# EAGLE design led_strip (EAGLE 6.1)
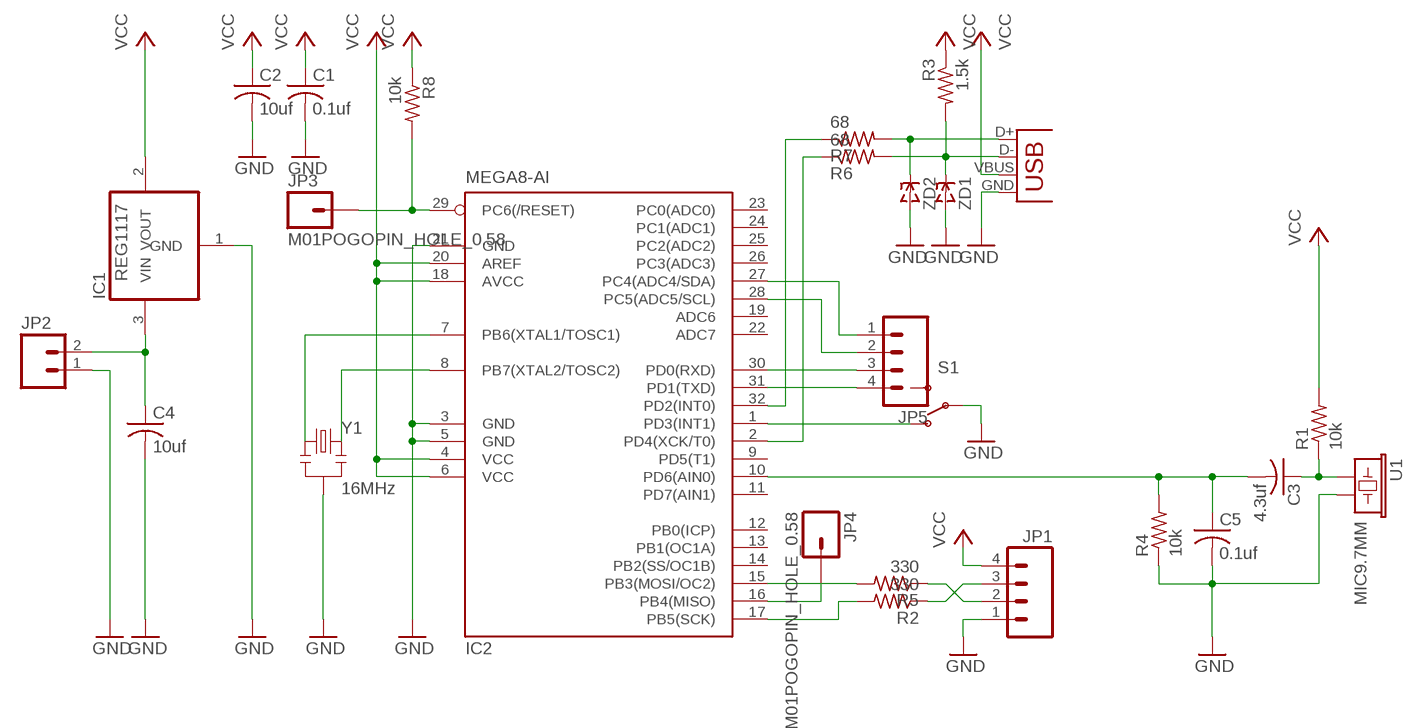
[diagram p0: schematic, sheet 1]

## Parts
C1  0.1uf  C-USC0805  [C0805]
C2  10uf  C-USC0805  [C0805]
C3  4.3uf  C-USC0805  [C0805]
C4  10uf  C-USC0805  [C0805]
C5  0.1uf  C-USC0805  [C0805]
IC1  REG1117  [SOT223]
IC2  MEGA8-AI  [TQFP32-08]
JP1  M04LONGPADS  [1X04_LONGPADS]
JP2  M02LOCK_LONGPADS  [1X02_LOCK_LONGPADS]
JP3  M01POGOPIN_HOLE_0.58  [1X01_POGOPIN_HOLE_0.58]
JP4  M01POGOPIN_HOLE_0.58  [1X01_POGOPIN_HOLE_0.58]
JP5  M04PTH  [1X04]
R1  10k  R-US_R0805  [R0805]
R2  330  R-US_R0805  [R0805]
R3  1.5k  R-US_R0805  [R0805]
R4  10k  R-US_R0805  [R0805]
R5  330  R-US_R0805  [R0805]
R6  68  R-US_R0805  [R0805]
R7  68  R-US_R0805  [R0805]
R8  10k  R-US_R0805  [R0805]
S1  SWITCH-SPSTSMD2  [SWITCH-SPDT-SMD]
U1  MIC9.7MM  [MIC-9.7MM]
X1  USB-SMD-NS  [USB-MINIB-NOSTOP]
Y1  16MHz  RESONATORSMD  [RESONATOR-SMD]
ZD1  ZENERSOD-323F  [SOD-323F]
ZD2  ZENERSOD-323F  [SOD-323F]

## Nets
GND: C1.2 C2.2 C4.2 C5.2 IC1.1(GND) IC2.3(GND) IC2.5(GND) IC2.21(GND) JP1.1 JP2.1 R4.1 S1.2(P) U1.2 X1.GND Y1.2 ZD1.A ZD2.A
N$1: IC2.17(PB5(SCK)) R2.2
N$2: IC2.16(PB4(MISO)) JP4.1
N$3: JP1.2 R5.1
N$4: R7.2 X1.D+ ZD2.C
N$5: R3.2 R6.2 X1.D- ZD1.C
N$6: IC2.7(PB6(XTAL1/TOSC1)) Y1.1
N$7: IC2.29(PC6(/RESET)) JP3.1 R8.2
N$8: IC2.8(PB7(XTAL2/TOSC2)) Y1.3
N$9: C3.2 C5.1 IC2.10(PD6(AIN0)) R4.2
N$10: C3.1 R1.1 U1.1
N$11: IC2.2(PD4(XCK/T0)) R6.1
N$12: IC2.32(PD2(INT0)) R7.1
N$13: IC2.1(PD3(INT1)) S1.1(O)
N$14: JP1.3 R2.1
N$15: IC2.15(PB3(MOSI/OC2)) R5.2
N$16: IC2.30(PD0(RXD)) JP5.3
N$17: IC2.31(PD1(TXD)) JP5.4
N$18: IC2.28(PC5(ADC5/SCL)) JP5.2
N$19: IC2.27(PC4(ADC4/SDA)) JP5.1
N$20: C4.1 IC1.3(VIN) JP2.2
VCC: C1.1 C2.1 IC1.2(VOUT) IC2.4(VCC) IC2.6(VCC) IC2.18(AVCC) IC2.20(AREF) JP1.4 R1.2 R3.1 R8.1 X1.VBUS
Unconnected: IC2.9(PD5(T1)) IC2.11(PD7(AIN1)) IC2.12(PB0(ICP)) IC2.13(PB1(OC1A)) IC2.14(PB2(SS/OC1B)) IC2.19(ADC6) IC2.22(ADC7) IC2.23(PC0(ADC0)) IC2.24(PC1(ADC1)) IC2.25(PC2(ADC2)) IC2.26(PC3(ADC3)) S1.3(S)

## Library data of the parts
C1-C5 = adafruit:C-US: CAPACITOR, American symbol
IC1 = burr-brown:REG1117: 800mA and 1A Low Dropout (LDO) Positive Regulator 1.8V, 2.5V, 2.85V, 3.3V, 5V, and Adj; MPN: REG1117; OC_FARNELL: 1097566; OC_NEWARK: 14P6981
IC2 = atmel:MEGA8: MICROCONTROLLER 8 Kbytes FLASH, 1 kbytes SRAM, 512 bytes EEPROM, USART, 6-channel 10 bit ADC, 2-channel 8 bit ADC Pin compatible with Atmega48, ATMega88, ATMega168 Source: avr.lbr; MPN: ATMEGA8-16AU; OC_FARNELL: 9171371; OC_NEWARK: 73M8863
JP1 JP5 = sparkfun:M04: Header 4 Standard 4-pin 0.1" header. Use with straight break away headers (SKU : PRT-00116), right angle break away headers (PRT-00553), swiss pins (PRT-00743), machine pins (PRT-00117), and female headers (PRT-00115). Molex polarized connector foot print use with SKU : PRT-08231 with associated crimp pins and housings. 1MM SMD Version SKU: PRT-10208
JP2 = sparkfun:M02: Header 2 Standard 2-pin 0.1" header. Use with straight break away headers (SKU : PRT-00116), right angle break away headers (PRT-00553), swiss pins (PRT-00743), machine pins (PRT-00117), and female headers (PRT-00115). Molex polarized connector foot print use with SKU : PRT-08233 with associated crimp pins and housings.
JP3 JP4 = sparkfun:M01: Header 1 Standard 1-pin 0.1" header. Use with straight break away headers (SKU : PRT-00116), right angle break away headers (PRT-00553), swiss pins (PRT-00743), machine pins (PRT-00117), and female headers (PRT-00115).
R1-R8 = adafruit:R-US_: RESISTOR, American symbol
S1 = sparkfun:SWITCH-SPST: SPST Switch Simple slide switch. Spark Fun Electronics SKU : COM-00102
U1 = sparkfun:MIC: Microphone Omni-directional electret microphone. 9.7mm standard diameter.
X1 = sparkfun:USB: USB Connectors USB-B-PTH is fully proven SKU : PRT-00139 USB-miniB is fully proven SKU : PRT-00587 USB-A-PCB is untested. USB-A-H is throughly reviewed, but untested. Spark Fun Electronics SKU : PRT-00437 USB-B-SMT is throughly reviewed, but untested. Needs silkscreen touching up. USB-A-S has not been used/tested USB-MB-H has not been used/tested
Y1 = sparkfun:RESONATOR: Resonator Small SMD resonator. This is the itty bitty 10/20MHz resonators with built in caps. CSTCE10M0G55 and CSTCE20M0V53. Footprint has been reviewed closely but hasn't been tested yet.
ZD1 ZD2 = dp_devices:ZENER: Zener Diode SOD-323

## Board
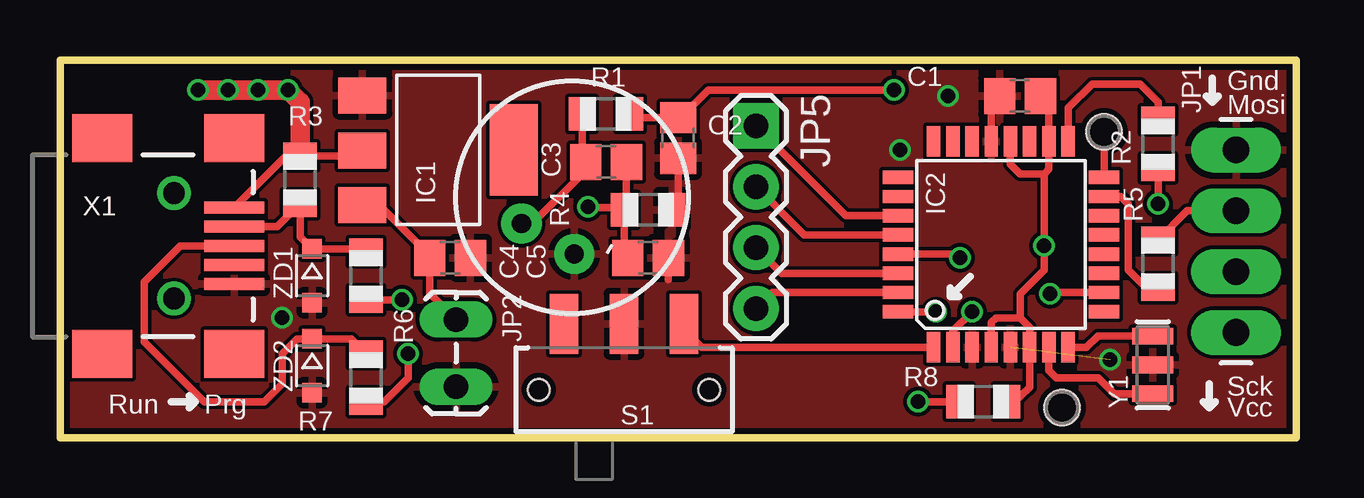
[diagram p1: board, top side]
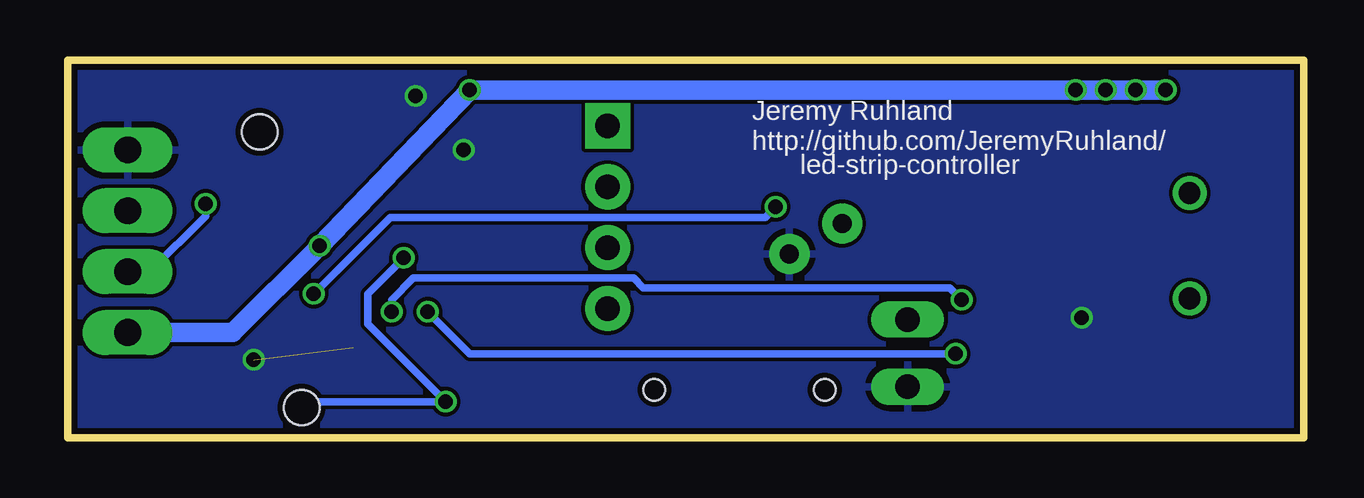
[diagram p2: board, bottom side, seen from below]

Size 51.5 x 15.75 mm. Coordinates in mm from the lower left corner, seen from the top.
Outline: 0,15.75 51.5,15.75 51.5,0 0,0 0,15.75
Copper layers (1*16): Top 0.035mm / dielectric 1.5mm / Bottom 0.035mm
Design rules: minimum track width 6mil, minimum drill 12mil, track to track 6mil, track to pad 6mil, pad to pad 6mil, via to via 6mil, smd to smd 0mil, copper to edge 10mil, drill to drill 10mil, minimum pad ring 10mil, minimum via ring 6mil, stop-mask expansion 2mil, vias tented up to drill 100mil, thermal gap 10mil

### Footprints (pad centres in the part's own frame; a part is rotated, then mirrored left to right if it is on the bottom)
C0805 = smd 1.3 x 1.5: 1 -0.85,0; 2 0.85,0
SOT223 = smd 1.499 x 2.007: 1 -2.261,-3.15; 2 0.025,-3.15; 3 2.311,-3.15 | smd 3.81 x 2.007: 4 0,3.15
TQFP32-08 = smd 1.27 x 0.559: 1 -4.293,2.8; 2 -4.293,2; 3 -4.293,1.2; 4 -4.293,0.4; 5 -4.293,-0.4; 6 -4.293,-1.2; 7 -4.293,-2; 8 -4.293,-2.8; 17 4.293,-2.8; 18 4.293,-2; 19 4.293,-1.2; 20 4.293,-0.4; 21 4.293,0.4; 22 4.293,1.2; 23 4.293,2; 24 4.293,2.8 | smd 0.559 x 1.27: 9 -2.8,-4.293; 10 -2,-4.293; 11 -1.2,-4.293; 12 -0.4,-4.293; 13 0.4,-4.293; 14 1.2,-4.293; 15 2,-4.293; 16 2.8,-4.293; 25 2.8,4.293; 26 2,4.293; 27 1.2,4.293; 28 0.4,4.293; 29 -0.4,4.293; 30 -1.2,4.293; 31 -2,4.293; 32 -2.8,4.293
1X04_LONGPADS = drill 1.118 pad 1.88 long: 1 0,0; 2 2.54,0; 3 5.08,0; 4 7.62,0
1X02_LOCK_LONGPADS = drill 1.016 long: 1 -0.127,0; 2 2.667,0
1X01_POGOPIN_HOLE_0.58 = drill 0.9 pad 0.813: 1 0,0 | hole 1.473: 0,0
1X04 = drill 1.016 pad 1.88 square: 1 0,0 | drill 1.016 pad 1.88: 2 2.54,0; 3 5.08,0; 4 7.62,0
R0805 = smd 1.1 x 1.4: 1 -1,0; 2 1,0
SWITCH-SPDT-SMD = smd 1.2 x 2.5: 1 -2.5,-2.75; 2 0,-2.75; 3 2.5,-2.75 | hole 0.9: -3.55,0; 3.55,0
MIC-9.7MM = drill 0.8 pad 1.676: 1 -2,1.27; 2 -2,-1.27
USB-MINIB-NOSTOP = smd 2.5 x 0.5: D+ 2.5,0; D- 2.5,0.8; GND 2.5,-1.6; ID 2.5,-0.8; VBUS 2.5,1.6 | smd 2.5 x 2: G1 -3,-4.5; G2 -3,4.5; G3 2.5,4.5; G4 2.5,-4.5 | drill 0.9 pad 0.8: H1 0,2.2 | drill 0.9 pad 0.787: H2 0,-2.2
RESONATOR-SMD = smd 0.7 x 1.7: 1 -1.2,0; 2 0,0; 3 1.2,0
SOD-323F = smd 0.8 x 0.8: A 1.125,0; C -1.125,0

### Placement (x,y rotation side)
C1  40,14.25 180 top
C2  25.75,12.5 270 top
C3  22.75,11.5 0 top
C4  16.25,7.5 0 top
C5  24.5,7.5 0 top
IC1  15.75,12 270 top
IC2  39.2,8.05 90 top
JP1  49,12 270 top
JP2  16.5,2.25 90 top
JP3  41.75,1.25 0 top
JP4  43.5,12.75 0 top
JP5  29,13 270 top
R1  22.75,13.5 0 top
R2  45.75,12.25 90 top
R3  10,10.75 270 top
R4  24.5,9.5 180 top
R5  45.75,7.25 270 top
R6  12.75,6.75 90 top
R7  12.75,2.5 90 top
R8  38.47,1.5 180 top
S1  23.5,2 180 top
U1  21.33,10.02 60 top
X1  4.75,8 0 top
Y1  45.53,3.03 90 top
ZD1  10.5,6.75 270 top
ZD2  10.5,3 270 top

### Tracks (layer width: path | path; a pad name or v marks a point on that pad's centre or on a via)
GND  (via drill 0.6)  (1 unrouted)
  Top 0.305: IC2.21 38.8,13.9 C1.2 | C5.2 25.35,6.6 | C2.2 25.75,9.75 R4.1
  other vias: 35,12 37,14.25 43.75,3.25 9.25,5
  pour Top: 0.25,15.75 51.5,15.75 51.5,0 0.25,0
  pour Bottom: 0.25,15.75 51.5,15.75 51.5,0 0.25,0
N$1
  Top 0.305: IC2.17 42,13.75 43,14.75 45,14.75 45.75,14 R2.2
N$2
  Top 0.305: JP4.1 IC2.16
N$3
  Top 0.305: JP1.2 46.96,9.46 R5.1
N$4
  Top 0.305: R7.2 12.12,4.12 ZD2.C 9.88,4.12 9.25,3.5 9.25,2.25 8.5,1.5 6,1.5 3.5,4 3.5,6.5 5,8 X1.D+
N$5
  Top 0.305: R6.2 12.62,7.88 ZD1.C 10,8.38 R3.2 9.05,8.8 X1.D-
N$6
  Top 0.305: IC2.7 41.2,2.8 41.5,2.5 43.25,2.5 43.92,1.83 Y1.1
N$7  (via drill 0.6)
  Top 0.305: IC2.29 37.35,7.65 v37.5,7.5 | R8.2 v35.75,1.5
  Bottom 0.305: v35.75,1.5 36.5,1.5 | v37.5,7.5 39,6 39,4.75 v35.75,1.5 | JP3.1 41.5,1.5 v35.75,1.5
N$8
  Top 0.305: IC2.8 42.76,3.76 43.25,4.25 45.51,4.25 Y1.3
N$9  (via drill 0.6)
  Top 0.305: C3.2 23.6,9.6 | 23.6,9.6 R4.2 23.5,7.65 C5.1 | 23.6,9.6 21.9,9.6 v22,9.62 | IC2.10 41.3,6.05 v41.25,6
  Bottom 0.305: v41.25,6 38.06,9.19 22.44,9.19 v22,9.62
N$10
  Top 0.305: R1.1 21.75,11.65 C3.1 21.77,11.62 21.75,11.62 21.75,11 19.68,8.93 U1.1
N$11  (via drill 0.6)
  Top 0.305: IC2.2 37.2,4.45 v38,5.25 | v14.25,5.75 R6.1
  Bottom 0.305: v38,5.25 38,5.75 37.1,6.65 27.91,6.65 27.51,6.25 14.75,6.25 v14.25,5.75
N$12  (via drill 0.6)
  Top 0.305: v36.5,5.25 35,5.25 | 35,5.25 34.75,5.25 | IC2.32 35,5.25 | R7.1 13.5,1.5 14.5,2.5 v14.5,3.5
  Bottom 0.305: v14.5,3.5 34.75,3.5 v36.5,5.25
N$13
  Top 0.305: IC2.1 26.74,3.76 26,4.5 S1.1
N$14  (via drill 0.6)
  Top 0.305: v45.75,9.75 R2.1
  Bottom 0.305: JP1.3 48.08,6.92 45.75,9.25 v45.75,9.75
N$15
  Top 0.305: IC2.15 44.2,10.05 44.5,9.75 44.5,7 45.25,6.25 R5.2
N$16
  Top 0.305: IC2.30 30.07,6.85 JP5.3
N$17
  Top 0.305: IC2.31 29.67,6.05 JP5.4
N$18
  Top 0.305: IC2.28 31.01,8.45 JP5.2
N$19
  Top 0.305: IC2.27 32.75,9.25 JP5.1
N$20
  Top 0.305: JP2.2 15.4,6.02 C4.1 15.4,7.6 13.31,9.69 IC1.3
VCC  (via drill 0.6)
  Top 0.305: 41,11 41.2,11.2 IC2.18 41.2,13.8 40.75,14.25 C1.1 | 41,11 v41,8 41,7 40,6 40,5 | IC2.20 39.6,11.4 40,11 41,11 | IC2.4 38.8,4.8 39,5 40,5 | 40,5 40.4,4.6 IC2.6 40.4,2.1 39.75,1.5 R8.1 | IC1.2 12.38,11.75 R3.1 9.4,11.75 X1.VBUS | v5.75,14.5 5.5,14.5 | R1.2 23.9,13.35 C2.1 25.85,13.35 27,14.5 v34.75,14.5
  Top 0.813: R3.1 10,14 v9.5,14.5 v8.25,14.5 v7,14.5 v5.75,14.5
  Bottom 0.813: JP1.4 44.62,4.38 v41,8 v34.75,14.5 v5.75,14.5

### Text on the board
_tsilk: Gnd | Mosi | Sck | Run | Prg | Vcc
_bsilk: Jeremy Ruhland | http://github.com/JeremyRuhland/ | led-strip-controller